# EAGLE schematic Arduino_MEGA2560_ref (EAGLE 8.0.1)
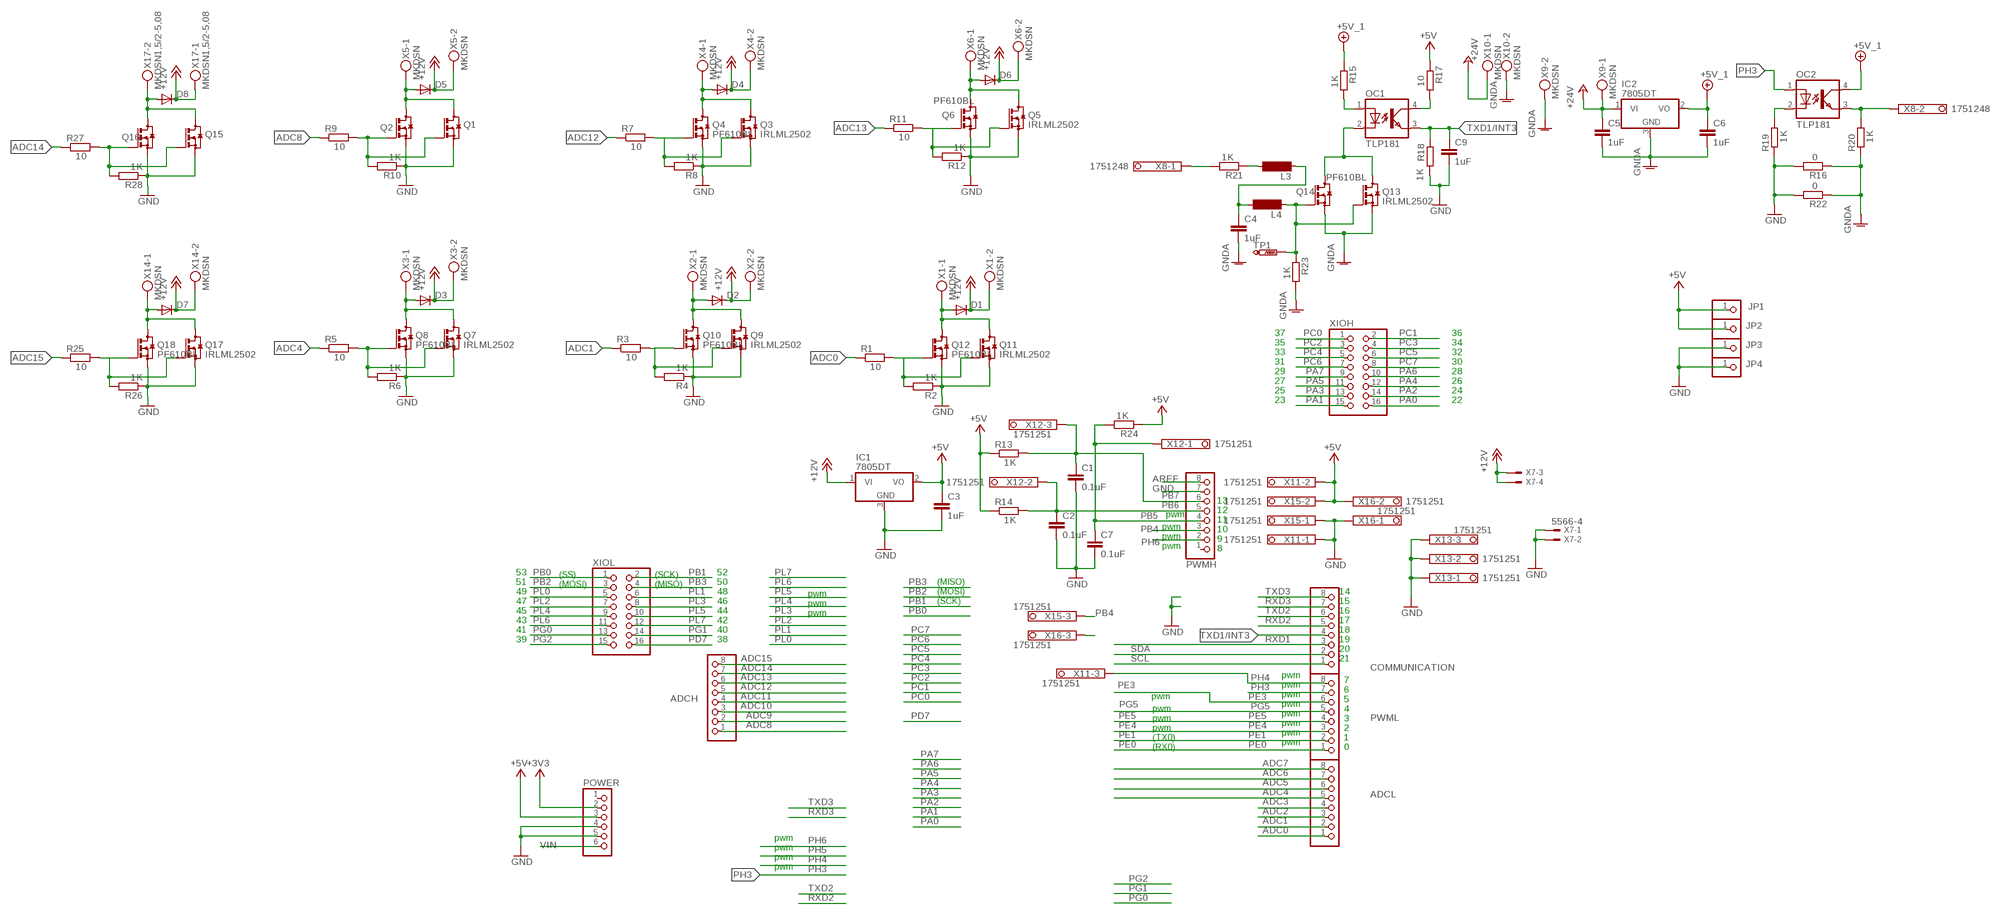
[diagram p0: schematic, sheet 1]

## Parts
ADCH  PINHD-1X8  [1X08]
ADCL  PINHD-1X8  [1X08]
C1  0.1uF  C-EUC0805  [C0805]
C2  0.1uF  C-EUC0805  [C0805]
C3  1uF  C-EUC0805  [C0805]
C4  1uF  C-EUC0805  [C0805]
C5  1uF  C-EUC0805  [C0805]
C6  1uF  C-EUC0805  [C0805]
C7  0.1uF  C-EUC0805  [C0805]
C9  1uF  C-EUC0805  [C0805]
COMMUNICATION  PINHD-1X8  [1X08]
D1  DIODE-DO214AA  [DO214AA]
D2  DIODE-DO214AA  [DO214AA]
D3  DIODE-DO214AA  [DO214AA]
D4  DIODE-DO214AA  [DO214AA]
D5  DIODE-DO214AA  [DO214AA]
D6  DIODE-DO214AA  [DO214AA]
D7  DIODE-DO214AA  [DO214AA]
D8  DIODE-DO214AA  [DO214AA]
IC1  7805DT  [TO252]
IC2  7805DT  [TO252]
JP1  PINHD-1X1  [1X01]
JP2  PINHD-1X1  [1X01]
JP3  PINHD-1X1  [1X01]
JP4  PINHD-1X1  [1X01]
L3  SM-NE45  [SM-NE45]
L4  SM-NE45  [SM-NE45]
OC1  TLP181  [SO-4]
OC2  TLP181  [SO-4]
POWER  PINHD-1X6  [1X06]
PWMH  PINHD-1X8  [1X08]
PWML  PINHD-1X8  [1X08]
Q1  IRLML2502  [SOT23]
Q2  PF610BL  [SOT223]
Q3  IRLML2502  [SOT23]
Q4  PF610BL  [SOT223]
Q5  IRLML2502  [SOT23]
Q6  PF610BL  [SOT223]
Q7  IRLML2502  [SOT23]
Q8  PF610BL  [SOT223]
Q9  IRLML2502  [SOT23]
Q10  PF610BL  [SOT223]
Q11  IRLML2502  [SOT23]
Q12  PF610BL  [SOT223]
Q13  IRLML2502  [SOT23]
Q14  PF610BL  [SOT223]
Q15  IRLML2502  [SOT23]
Q16  PF610BL  [SOT223]
Q17  IRLML2502  [SOT23]
Q18  PF610BL  [SOT223]
R1  10  R-EU_M0805  [M0805]
R2  1K  R-EU_M0805  [M0805]
R3  10  R-EU_M0805  [M0805]
R4  1K  R-EU_M0805  [M0805]
R5  10  R-EU_M0805  [M0805]
R6  1K  R-EU_M0805  [M0805]
R7  10  R-EU_M0805  [M0805]
R8  1K  R-EU_M0805  [M0805]
R9  10  R-EU_M0805  [M0805]
R10  1K  R-EU_M0805  [M0805]
R11  10  R-EU_M0805  [M0805]
R12  1K  R-EU_M0805  [M0805]
R13  1K  R-EU_M0805  [M0805]
R14  1K  R-EU_M0805  [M0805]
R15  1K  R-EU_M0805  [M0805]
R16  0  R-EU_M0805  [M0805]
R17  10  R-EU_M0805  [M0805]
R18  1K  R-EU_M0805  [M0805]
R19  1K  R-EU_M0805  [M0805]
R20  1K  R-EU_M0805  [M0805]
R21  1K  R-EU_M0805  [M0805]
R22  0  R-EU_M0805  [M0805]
R23  1K  R-EU_M0805  [M0805]
R24  1K  R-EU_M0805  [M0805]
R25  10  R-EU_M0805  [M0805]
R26  1K  R-EU_M0805  [M0805]
R27  10  R-EU_M0805  [M0805]
R28  1K  R-EU_M0805  [M0805]
TP1  PTR1TP20SQ  [TP20SQ]
X1  MKDSN  MKDSN1,5/2-5,08  [MKDSN1,5/2-5,08]
X2  MKDSN  MKDSN1,5/2-5,08  [MKDSN1,5/2-5,08]
X3  MKDSN  MKDSN1,5/2-5,08  [MKDSN1,5/2-5,08]
X4  MKDSN  MKDSN1,5/2-5,08  [MKDSN1,5/2-5,08]
X5  MKDSN  MKDSN1,5/2-5,08  [MKDSN1,5/2-5,08]
X6  MKDSN  MKDSN1,5/2-5,08  [MKDSN1,5/2-5,08]
X7  5566-4  [5566-4]
X8  1751248  [1751248]
X9  MKDSN  MKDSN1,5/2-5,08  [MKDSN1,5/2-5,08]
X10  MKDSN  MKDSN1,5/2-5,08  [MKDSN1,5/2-5,08]
X11  1751251  [1751251]
X12  1751251  [1751251]
X13  1751251  [1751251]
X14  MKDSN  MKDSN1,5/2-5,08  [MKDSN1,5/2-5,08]
X15  1751251  [1751251]
X16  1751251  [1751251]
X17  MKDSN1,5/2-5,08  [MKDSN1,5/2-5,08]
XIOH  PINHD-2X8  [2X08]
XIOL  PINHD-2X8  [2X08]

## Nets
+3V3: POWER.2
+5V: C3.1 IC1.2(VO) JP1.1 JP2.1 POWER.3 R13.1 R14.1 R17.1 R24.1 X11.2 X15.2 X16.2
+5V_1: C6.1 IC2.2(VO) OC2.4(COL) R15.1
+12V: D1.C D2.C D3.C D4.C D5.C D6.C D7.C D8.C IC1.1(VI) X1.2 X2.2 X3.2 X4.2 X5.2 X6.2 X7.3 X7.4 X14.2 X17.1
+24V: C5.1 IC2.1(VI) X9.1 X10.1
ADC0: ADCL.1 R1.1
ADC1: ADCL.2 R3.1
ADC2: ADCL.3
ADC3: ADCL.4
ADC4: ADCL.5 R5.1
ADC5: ADCL.6
ADC6: ADCL.7
ADC7: ADCL.8
ADC8: ADCH.1 R9.1
ADC9: ADCH.2
ADC10: ADCH.3
ADC11: ADCH.4
ADC12: ADCH.5 R7.1
ADC13: ADCH.6 R11.1
ADC14: ADCH.7 R27.1
ADC15: ADCH.8 R25.1
AREF: PWMH.8
GND: C1.2 C2.2 C3.2 C7.2 C9.2 IC1.3(GND) JP3.1 JP4.1 POWER.4 POWER.5 PWMH.7 Q1.S Q2.S Q3.S Q4.S Q5.S Q6.S Q7.S Q8.S Q9.S Q10.S Q11.S Q12.S Q15.S Q16.S Q17.S Q18.S R2.1 R4.1 R6.1 R8.1 R10.1 R12.1 R16.2 R18.1 R19.1 R22.2 R26.1 R28.1 X7.1 X7.2 X11.1 X13.1 X13.2 X13.3 X15.1 X16.1
GNDA: C4.2 C5.2 C6.2 IC2.3(GND) Q13.S Q14.S R16.1 R20.1 R22.1 R23.2 X9.2 X10.2
N$1: Q11.G Q12.G R1.2 R2.2
N$2: Q9.G Q10.G R3.2 R4.2
N$3: Q3.G Q4.G R7.2 R8.2
N$4: D1.A Q11.D Q12.D Q12.D_TAB(D) X1.1
N$5: Q7.G Q8.G R5.2 R6.2
N$6: D2.A Q9.D Q10.D Q10.D_TAB(D) X2.1
N$7: D3.A Q7.D Q8.D Q8.D_TAB(D) X3.1
N$8: D4.A Q3.D Q4.D Q4.D_TAB(D) X4.1
N$9: Q1.G Q2.G R9.2 R10.2
N$10: D5.A Q1.D Q2.D Q2.D_TAB(D) X5.1
N$11: Q5.G Q6.G R11.2 R12.2
N$12: D6.A Q5.D Q6.D Q6.D_TAB(D) X6.1
N$13: OC1.1(A) R15.2
N$14: OC1.2(C) Q13.D Q14.D Q14.D_TAB(D)
N$15: OC1.4(COL) R17.2
N$16: OC2.2(C) R19.2
N$17: L3.2 R21.1
N$18: OC2.3(EMIT) R20.2 X8.2
N$20: C4.1 L3.1 L4.2
N$21: L4.1 Q13.G Q14.G R23.1 TP1.TP
N$22: R21.2 X8.1
N$24: Q17.G Q18.G R25.2 R26.2
N$25: D7.A Q17.D Q18.D Q18.D_TAB(D) X14.1
N$26: Q15.G Q16.G R27.2 R28.2
N$27: D8.A Q15.D Q16.D Q16.D_TAB(D) X17.2
PA0: XIOH.16
PA1: XIOH.15
PA2: XIOH.14
PA3: XIOH.13
PA4: XIOH.12
PA5: XIOH.11
PA6: XIOH.10
PA7: XIOH.9
PB0: XIOL.1
PB1: XIOL.2
PB2: XIOL.3
PB3: XIOL.4
PB4: PWMH.3 X15.3
PB5: C7.1 PWMH.4 R24.2 X12.1
PB6: C2.1 PWMH.5 R14.2 X12.2
PB7: C1.1 PWMH.6 R13.2 X12.3
PC0: XIOH.1
PC1: XIOH.2
PC2: XIOH.3
PC3: XIOH.4
PC4: XIOH.5
PC5: XIOH.6
PC6: XIOH.7
PC7: XIOH.8
PD7: XIOL.16
PE0: PWML.1
PE1: PWML.2
PE3: PWML.6
PE4: PWML.3
PE5: PWML.4
PG0: XIOL.13
PG1: XIOL.14
PG2: XIOL.15
PG5: PWML.5
PH3: OC2.1(A) PWML.7
PH4: PWML.8 X11.3
PH6: PWMH.2 X16.3
PL0: XIOL.5
PL1: XIOL.6
PL2: XIOL.7
PL3: XIOL.8
PL4: XIOL.9
PL5: XIOL.10
PL6: XIOL.11
PL7: XIOL.12
RXD1: COMMUNICATION.3
RXD2: COMMUNICATION.5
RXD3: COMMUNICATION.7
SCL: COMMUNICATION.1
SDA: COMMUNICATION.2
TXD1/INT3: C9.1 COMMUNICATION.4 OC1.3(EMIT) R18.2
TXD2: COMMUNICATION.6
TXD3: COMMUNICATION.8
VIN: POWER.6
Unconnected: POWER.1 PWMH.1

## Notes on the sheet
- 37 | 36
- 35 | 34
- 33 | 32
- 31 | 30
- 29 | 28
- 27 | 26
- 25 | 24
- 23 | 22
- 13
- 12
- pwm
- 11
- pwm | 10
- pwm | 9
- pwm | 8
- 53 | (SS) | (SCK) | 52
- 51 | (MOSI) | (MISO) | 50 | (MISO)
- 49 | 48 | pwm | (MOSI) | 14
- 47 | 46 | pwm | (SCK) | 15
- 45 | 44 | pwm | 16
- 43 | 42 | 17
- 41 | 40 | 18
- 39 | 38 | 19
- 20
- 21
- pwm
- 7
- pwm
- 6
- pwm | pwm
- 5
- pwm
- pwm | 4
- pwm
- pwm | 3
- pwm
- pwm | 2
- pwm
- (TX0) | 1
- pwm
- (RX0) | 0
- pwm
- pwm
- pwm
- pwm

## Library data of the parts
ADCH ADCL COMMUNICATION PWMH PWML = pinhead:PINHD-1X8: PIN HEADER
C1-C7 C9 = resistor:C-EU: CAPACITOR, European symbol
D1-D8 = diode:DIODE-: DIODE
IC1 IC2 = linear:78*: Positive VOLTAGE REGULATOR Source: http://cache.national.com/ds/LM/LM78L05.pdf http://www.fairchildsemi.com/ds/LM/LM7805.pdf
JP1-JP4 = pinhead:PINHD-1X1: PIN HEADER
L3 L4 = inductor-neosid:SM-NE45: INDUCTOR SMD chip inductor; OC_FARNELL: unknown; OC_NEWARK: unknown
OC1 OC2 = optocoupler-3-jcn:TLP181
POWER = pinhead:PINHD-1X6: PIN HEADER
Q1 Q3 Q5 Q7 Q9 Q11 Q13 Q15 Q17 = NFET_transistors:IRLML2502
Q2 Q4 Q6 Q8 Q10 Q12 Q14 Q16 Q18 = NFET_transistors:PF610BL
R1-R28 = resistor:R-EU_: RESISTOR, European symbol
TP1 = testpad:PTR1: TEST PIN
X1-X6 X9 X10 X14 X17 = con-phoenix-508:MKDSN1,5/2-5,08: MKDSN 1,5/ 2-5,08 Printklemme Nennstrom: 13,5 A Nennspannung: 250 V Rastermaß: 5,08 mm Polzahl: 2 Anschlussart: Schraubanschluss Montage: Löten Anschlussrichtung Leiter/Platine: 0 ° Artikelnummer: 1729128 Source: http://eshop.phoenixcontact.com .. 1729128.pdf
X7 = con-molex:5566-4: Mini FIT connector 4 pol Source: http://www.molex.com; OC_FARNELL: unknown; OC_NEWARK: unknown
X8 = con-phoenix-350:1751248: MKDS 1/ 2-3,5 Printklemme Nennstrom: 10 A Bemessungsspannung: 160 V Raster: 3,5 mm Polzahl: 2 Montageart: Löten Anschlussart: Schraubanschluss Anschlussrichtung vom Leiter zur Platine: 0° Source: http://eshop.phoenixcontact.com .. 1751248.pdf; OC_FARNELL: unknown; OC_NEWARK: unknown
X11-X13 X15 X16 = con-phoenix-350:1751251: MKDS 1/ 3-3,5 Printklemme Nennstrom: 10 A Bemessungsspannung: 160 V Raster: 3,5 mm Polzahl: 3 Montageart: Löten Anschlussart: Schraubanschluss Anschlussrichtung vom Leiter zur Platine: 0° Source: http://eshop.phoenixcontact.com .. 1751251.pdf; OC_FARNELL: unknown; OC_NEWARK: unknown
XIOH XIOL = pinhead:PINHD-2X8: PIN HEADER

## Net classes
0 default: width 0.152 mm, drill 0.305 mm, clearance 0.152 mm